# Altium schematic sheet Lesson_05.SchDoc
size A4
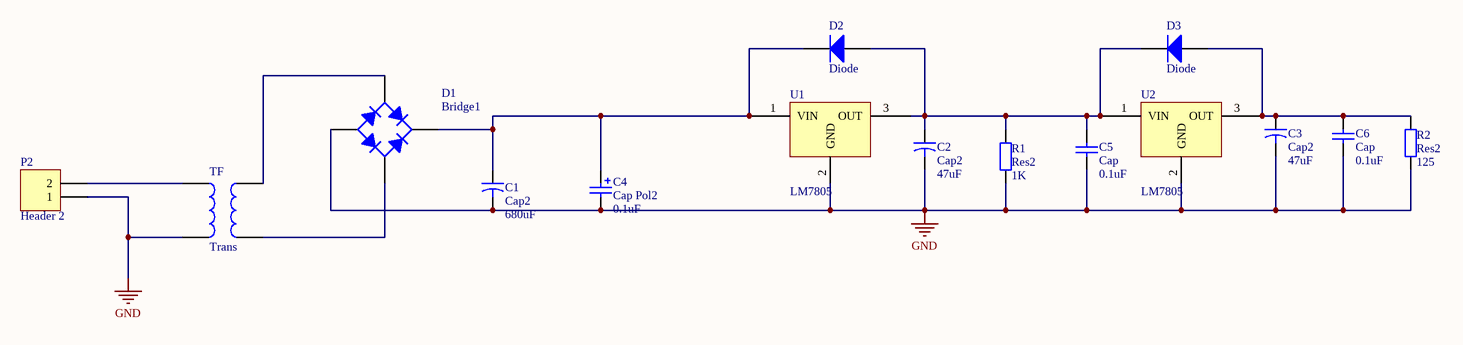
[diagram p0: Lesson_05.SchDoc]

## Parts
C1  Cap2  value 680uF  [CAPR5-4X5]
C2  Cap2  value 47uF  [CAPR5-4X5]
C3  Cap2  value 47uF  [CAPR5-4X5]
C4  Cap Pol2  value 0.1uF  [POLAR0.8]
C5  Cap  value 0.1uF  [RAD-0.3]
C6  Cap  value 0.1uF  [RAD-0.3]
D1  Bridge1  [D-38]
D2  Diode  [SMC]
D3  Diode  [SMC]
P2  Header 2  [HDR1X2]
R1  Res2  value 1K  [AXIAL-0.4]
R2  Res2  value 125  [AXIAL-0.4]
TF  Trans  [TRANS]
U1  LM7805  [LM7805-TO220 - duplicate]
U2  LM7805  [LM7805-TO220 - duplicate]

## Nets
GND: C1.2 C2.2 C3.2 C4.2 C5.1 C6.1 D1.3(A) P2.1 R1.1 R2.1 TF.2 U1.2(GND) U2.2(GND)
NetC1_1: C1.1 C4.1 D1.1(K) D2.2(K) U1.1(VIN)
NetC2_1: C2.1 C5.2 D2.1(A) D3.2(K) R1.2 U1.3(OUT) U2.1(VIN)
NetC3_1: C3.1 C6.2 D3.1(A) R2.2 U2.3(OUT)
NetD1_2: D1.2(C) TF.4
NetD1_4: D1.4(C) TF.3
NetP2_2: P2.2 TF.1

## Library data of the parts
C1-C3 = Cap2: Capacitor; Published: 23-Sep-2002; PackageReference: CAPR5-4X5; Publisher: Altium Limited; PackageDescription: Capacitor; 2 Leads
C4 = Cap Pol2: Polarized Capacitor (Axial); Published: 8-Jun-2000; LatestRevisionDate: 17-Jul-2002; LatestRevisionNote: Re-released for DXP Platform.; PackageReference: POLAR0.8; Publisher: Altium Limited; PackageDescription: Polarized Capacitor; 2 Leads
C5 C6 = Cap: Capacitor; Published: 8-Jun-2000; LatestRevisionDate: 17-Jul-2002; LatestRevisionNote: Re-released for DXP Platform.; PackageReference: RAD-0.3; Publisher: Altium Limited; PackageDescription: Radial Cap, Thru-Hole; 2 Leads; 0.3 in Pin Spacing
D1 = Bridge1: Full Wave Diode Bridge; Published: 8-Jun-2000; LatestRevisionDate: 29-May-2009; LatestRevisionNote: Sch pins A & K swapped.; DatasheetVersion: E2732B; PackageReference: D-38; Publisher: Altium Limited; PackageDescription: Bridge Rectifier; 4 Terminals; Body 9.4 x 9.4 mm (typ); Pitch 5.08 mm
D2 D3 = Diode: Default Diode; Published: 8-Jun-2000; LatestRevisionDate: 17-Jul-2002; LatestRevisionNote: Re-released for DXP Platform.; PackageVersion: Sep-1996; PackageReference: SMC; Publisher: Altium Limited; PackageDescription: DO-214-AB/SMC; 2 C-Bend Leads; Body 7.9 x 5.9 mm, inc. leads (LxW); Code_JEDEC: DO-214-AB
P2 = Header 2: Header, 2-Pin; LatestRevisionDate: 17-Jul-2002; LatestRevisionNote: Re-released for DXP Platform.; Publisher: Altium Limited
R1 R2 = Res2: Resistor; Published: 8-Jun-2000; LatestRevisionDate: 17-Jul-2002; LatestRevisionNote: Re-released for DXP Platform.; PackageReference: AXIAL-0.4; Publisher: Altium Limited; PackageDescription: Axial Device, Thru-Hole; 2 Leads; 0.4 in Pin Spacing
TF = Trans: Transformer; Published: 24-Mar-1999; LatestRevisionDate: 08-Jul-2005; LatestRevisionNote: Mech Layer 1 removed.; PackageReference: TRANS; Publisher: Altium Limited; PackageDescription: Transformer; 4 Leads